# EAGLE design 8mixer (EAGLE 6.4)
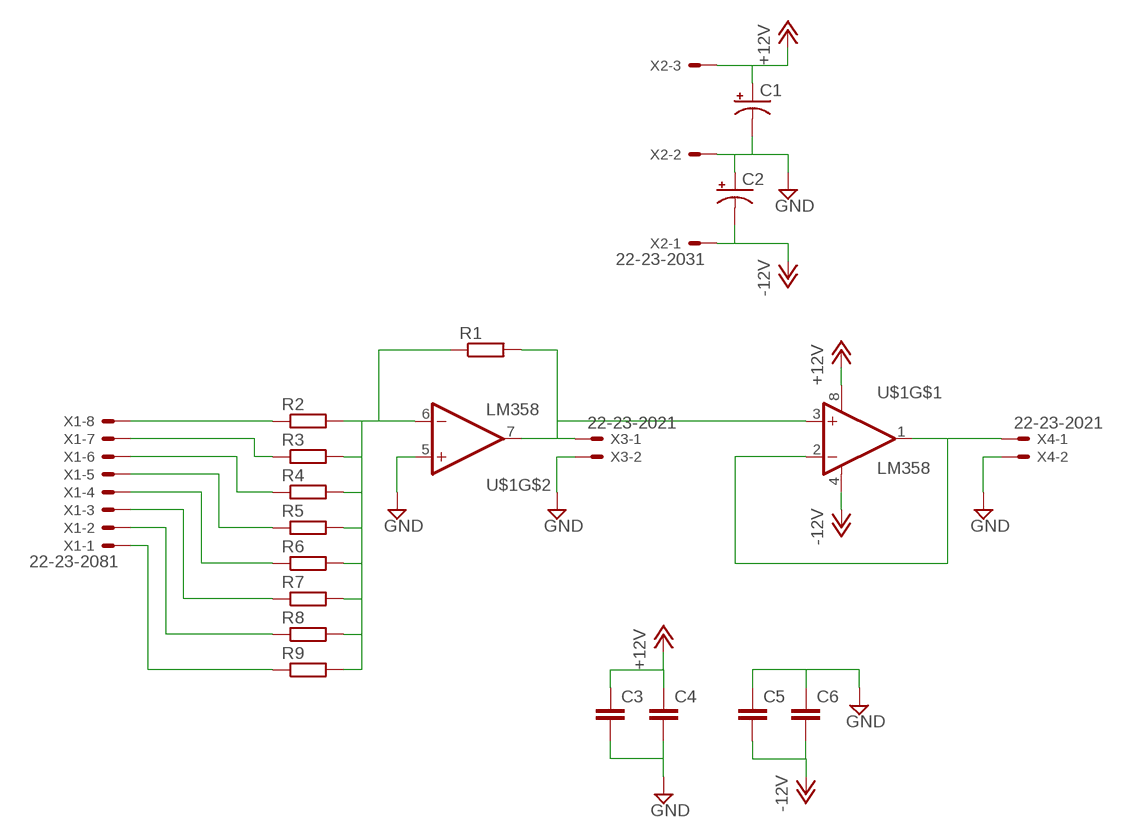
[diagram p0: schematic, sheet 1]

## Parts
C1  CPOL-USSMCE  [SMC_E]
C2  CPOL-USSMCE  [SMC_E]
C3  C-EUC0603K  [C0603K]
C4  C-EUC0603K  [C0603K]
C5  C-EUC0603K  [C0603K]
C6  C-EUC0603K  [C0603K]
R1  R-EU_R0603  [R0603]
R2  R-EU_R0603  [R0603]
R3  R-EU_R0603  [R0603]
R4  R-EU_R0603  [R0603]
R5  R-EU_R0603  [R0603]
R6  R-EU_R0603  [R0603]
R7  R-EU_R0603  [R0603]
R8  R-EU_R0603  [R0603]
R9  R-EU_R0603  [R0603]
U$1  LM358  [SO08]
X1  22-23-2081  [22-23-2081]
X2  22-23-2031  [22-23-2031]
X3  22-23-2021  [22-23-2021]
X4  22-23-2021  [22-23-2021]

## Nets
+12V: C1.+ C3.1 C4.1 U$1.8(V+) X2.3
-12V: C2.- C5.2 C6.2 U$1.4(V-) X2.1
GND: C1.- C2.+ C3.2 C4.2 C5.1 C6.1 U$1.5(+IN) X2.2 X3.2 X4.2
N$1: R1.1 R2.2 R3.2 R4.2 R5.2 R6.2 R7.2 R8.2 R9.2 U$1.6(-IN)
N$3: U$1.1(OUT) U$1.2(-IN) X4.1
N$4: R2.1 X1.8
N$5: R3.1 X1.7
N$6: R4.1 X1.6
N$7: R5.1 X1.5
N$8: R6.1 X1.4
N$9: R7.1 X1.3
N$10: R8.1 X1.2
N$11: R9.1 X1.1
N$14: R1.2 U$1.3(+IN) U$1.7(OUT) X3.1

## Library data of the parts
C1 C2 = rcl:CPOL-US: POLARIZED CAPACITOR, American symbol
C3-C6 = rcl:C-EU: CAPACITOR, European symbol
R1-R9 = rcl:R-EU_: RESISTOR, European symbol
U$1 = synth_design:LM358
X1 = con-molex:22-23-2081: .100" (2.54mm) Center Header - 8 Pin; MF: MOLEX; MPN: 22-23-2081; OC_FARNELL: 1756826; OC_NEWARK: 01C7592
X2 = con-molex:22-23-2031: .100" (2.54mm) Center Header - 3 Pin; MF: MOLEX; MPN: 22-23-2031; OC_FARNELL: 1462950; OC_NEWARK: 30C0862
X3 X4 = con-molex:22-23-2021: .100" (2.54mm) Center Header - 2 Pin; MF: MOLEX; MPN: 22-23-2021; OC_FARNELL: 1462926; OC_NEWARK: 25C3832

## Board
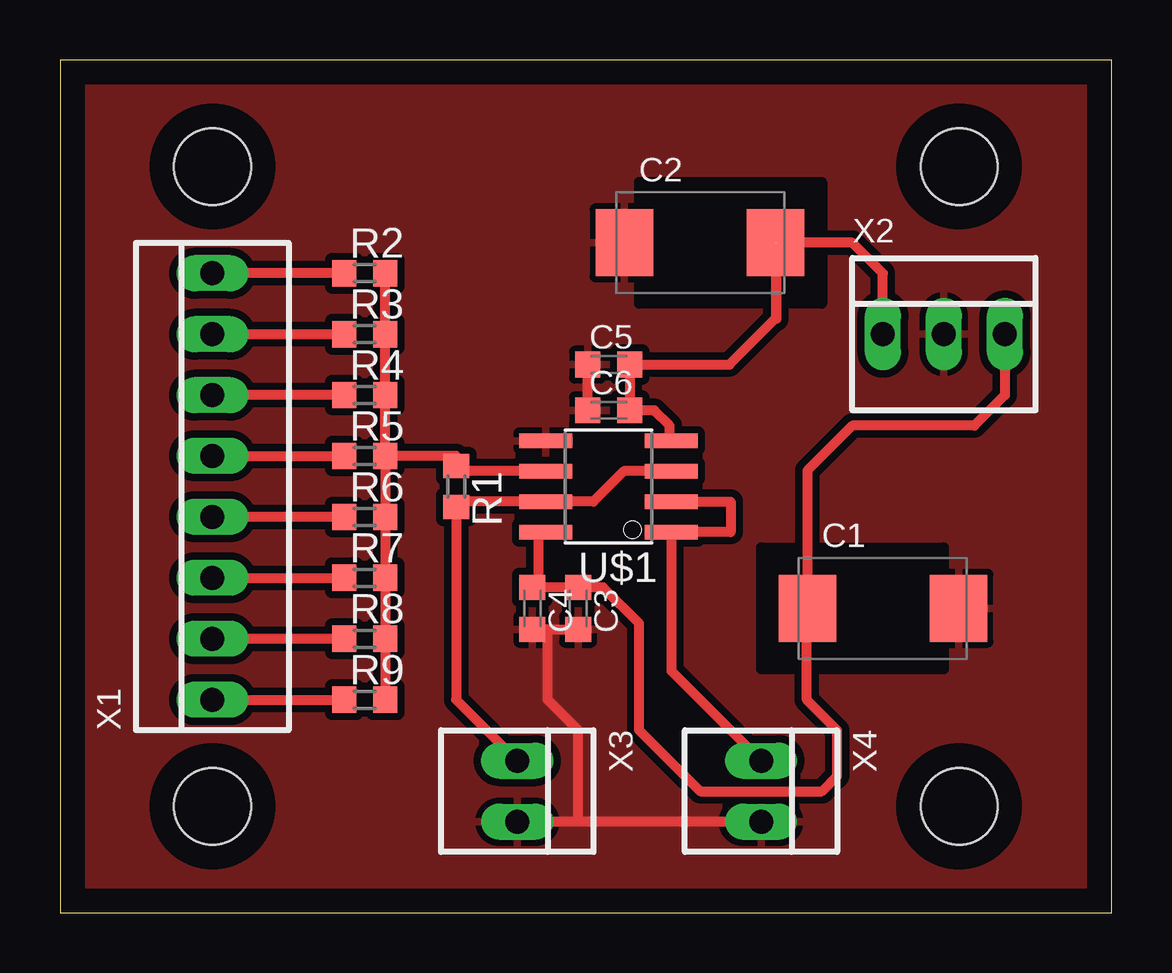
[diagram p1: board, top side]

Size 43.81 x 35.56 mm. Coordinates in mm from the lower left corner, seen from the top.
Outline: 43.81,0 43.81,35.56 0,35.56 0,0 43.81,0
Copper layers (1*16): Top 0.035mm / dielectric 1.5mm / Bottom 0.035mm
Design rules "default *": minimum track width 10mil, minimum drill 24mil, track to track 12mil, track to pad 12mil, pad to pad 12mil, via to via 12mil, smd to smd 8mil, copper to edge 40mil, drill to drill 8mil, minimum pad ring 10mil, minimum via ring 8mil, stop-mask expansion 4mil, vias tented up to drill 0mil, thermal gap 10mil
Holes 3.2 mm at 6.35,4.45 6.35,31.11 37.47,31.11 37.47,4.45
tRestrict: area 24.1,25.4 to 31.8,30.5; area 21.6,19.1 to 24.1,20.3; area 29.2,10.2 to 36.8,15.2

### Footprints (pad centres in the part's own frame; a part is rotated, then mirrored left to right if it is on the bottom)
SMC_E = smd 2.4 x 2.8: + -3.15,0; - 3.15,0
C0603K = smd 1.05 x 1.08: 1 -0.875,0; 2 0.875,0
R0603 = smd 1 x 1.1: 1 -0.85,0; 2 0.85,0
SO08 = smd 0.61 x 2.21: 1 -1.905,-2.616; 2 -0.635,-2.616; 3 0.635,-2.616; 4 1.905,-2.616; 5 1.905,2.616; 6 0.635,2.616; 7 -0.635,2.616; 8 -1.905,2.616
22-23-2081 = drill 1 long: 1 -8.89,0; 2 -6.35,0; 3 -3.81,0; 4 -1.27,0; 5 1.27,0; 6 3.81,0; 7 6.35,0; 8 8.89,0
22-23-2031 = drill 1 long: 1 -2.54,0; 2 0,0; 3 2.54,0
22-23-2021 = drill 1 long: 1 -1.27,0; 2 1.27,0

### Placement (x,y rotation side)
C1  34.29,12.7 0 top
C2  26.67,27.94 0 top
C3  21.59,12.7 270 top
C4  19.68,12.7 270 top
C5  22.86,22.86 0 top
C6  22.86,20.95 0 top
R1  16.51,17.78 270 top
R2  12.7,26.67 0 top
R3  12.7,24.13 0 top
R4  12.7,21.59 0 top
R5  12.7,19.05 0 top
R6  12.7,16.51 0 top
R7  12.7,13.97 0 top
R8  12.7,11.43 0 top
R9  12.7,8.89 0 top
U$1  22.86,17.78 90 top
X1  6.35,17.78 90 top
X2  36.83,24.13 0 top
X3  19.05,5.08 270 top
X4  29.21,5.08 270 top

### Tracks (layer width: path | path; a pad name or v marks a point on that pad's centre or on a via)
+12V
  Top 0.406: U$1.8 19.93,15.88 19.93,13.81 C4.1 C3.1 22.62,13.57 24.13,12.06 24.13,7.62 26.67,5.08 31.75,5.08 32.38,5.71 32.38,7.62 31.11,8.89 31.11,12.68 C1.+ 31.14,18.44 33.02,20.32 38.1,20.32 39.37,21.59 X2.3
-12V  (1 unrouted)
  Top 0.406: 25.8,19.68 U$1.4 25.4,19.76 25.4,20.32 24.77,20.95 C6.2 C5.2 27.89,22.86 29.82,24.79 C2.- | X2.1 34.29,26.67 33.02,27.94 29.84,27.94 29.84,24.77
GND
  Top 0.406: C6.1 C5.1 | X4.2 21.59,3.81 | 21.59,3.81 X3.2 | C4.2 20.32,11.82 | 20.32,11.82 C3.2 | 21.59,3.81 21.59,7.62 20.32,8.89 20.32,11.82
  pour Top: 0,35.56 43.81,35.56 43.81,0 0,0
N$1
  Top 0.406: U$1.6 16.51,18.41 R1.1 16.51,19.05 R5.2 | R5.2 R4.2 R3.2 R2.2 | R5.2 R6.2 R7.2 R8.2 R9.2
N$3
  Top 0.406: X4.1 25.48,10.08 U$1.1 27.94,15.88 27.94,17.14 U$1.2
N$4
  Top 0.406: R2.1 X1.8
N$5
  Top 0.406: X1.7 R3.1
N$6
  Top 0.406: R4.1 X1.6
N$7
  Top 0.406: X1.5 R5.1
N$8
  Top 0.406: R6.1 X1.4
N$9
  Top 0.406: X1.3 R7.1
N$10
  Top 0.406: R8.1 X1.2
N$11
  Top 0.406: X1.1 R9.1
N$14
  Top 0.406: X3.1 16.51,8.89 R1.2 16.51,17.14 U$1.7 22.23,17.14 23.5,18.41 U$1.3